# EasyEDA Pro project ProDoc_Board1_2026-06-09.epro

# Schematic Schematic1
Board Name: Board1; Create Date: 2025-09-25; Page Name: P1; Project Name: ESP32C3自动遥控; Schematic Name: Schematic1; Update Date: 2025-09-27; Company: 嘉立创EDA; Page Size: A4; Version: V1.0
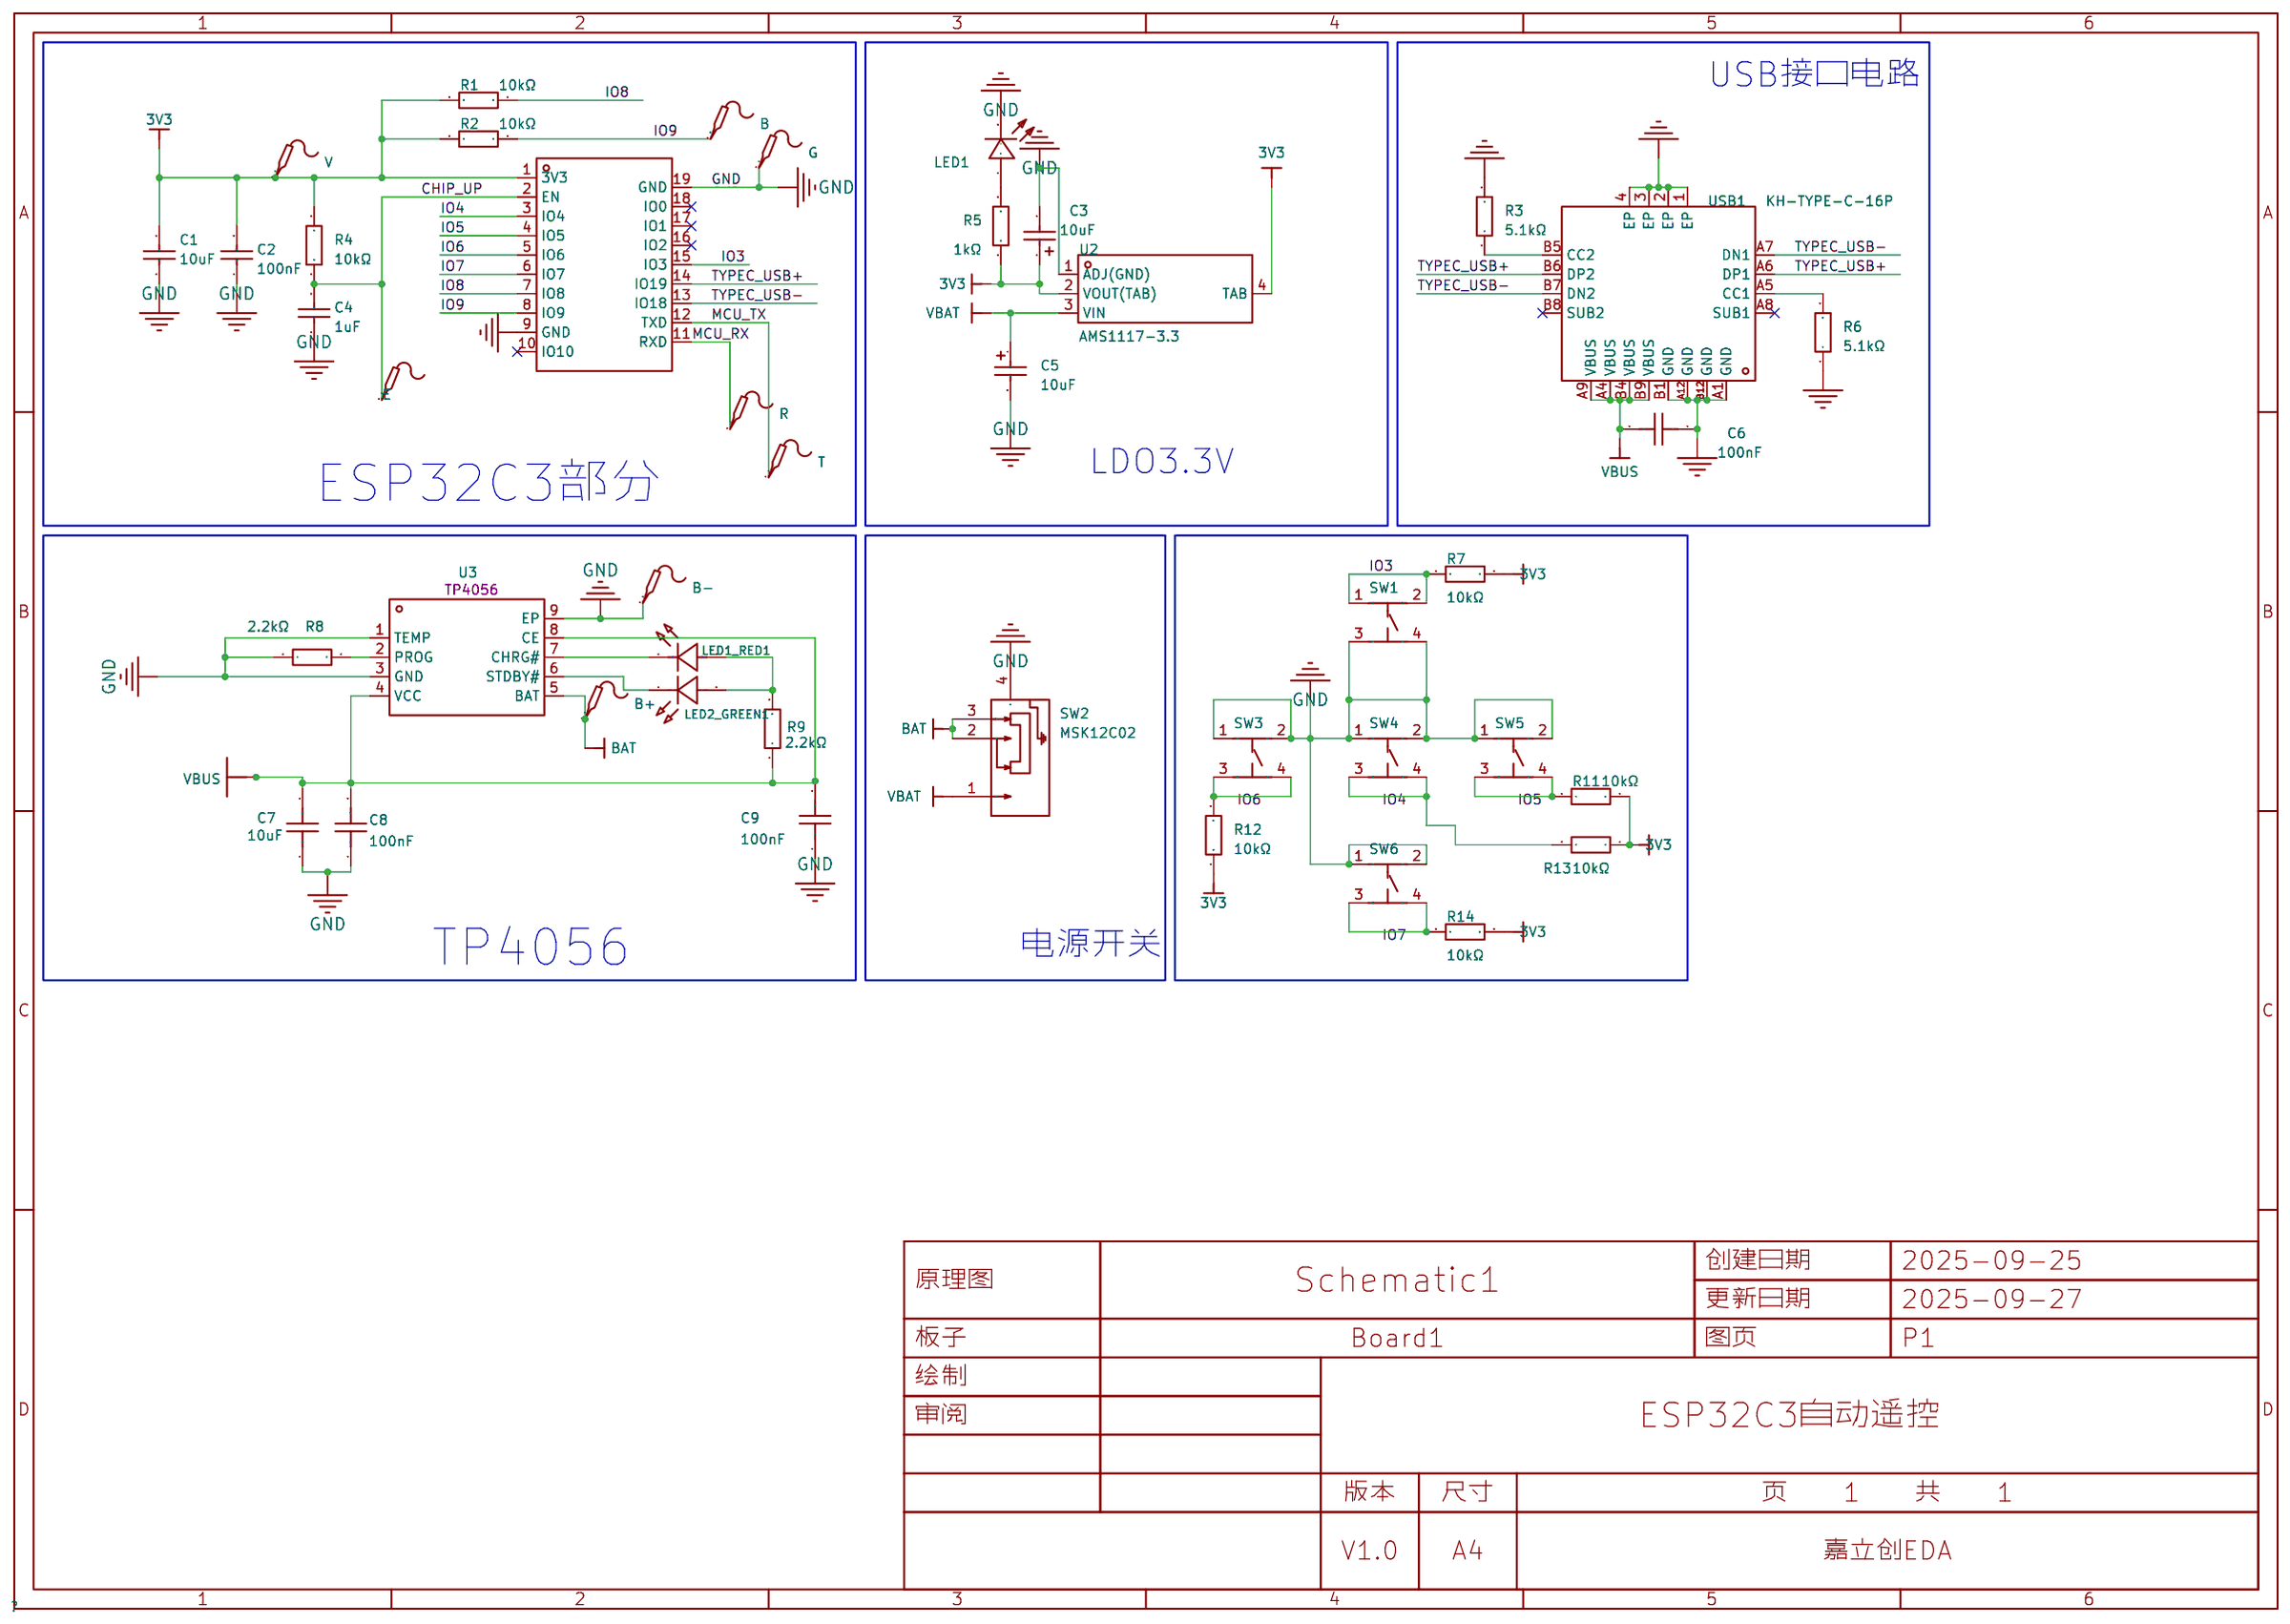
[diagram p0: schematic sheet]

## Parts
B  -  [Test-Point-0.5mm]
B+  -  [Test-Point-0.5mm]
B-  -  [Test-Point-0.5mm]
C1  10uF  [C0805]
C2  100nF  [C0805]
C3  10uF  [CAP-SMD_L3.2-W1.6-RD-C7171]
C4  1uF  [C0805]
C5  10uF  [CAP-SMD_L3.2-W1.6-RD-C7171]
C6  100nF  [C0603]
C7  10uF  [C0603]
C8  100nF  [C0603]
C9  100nF  [C0603]
E  -  [Test-Point-0.5mm]
G  -  [Test-Point-0.5mm]
LED1  NCD0805R1  [LED0805-R-RD]
LED1_RED1  -  [LED0805-RD_RED]
LED2_GREEN1  -  [LED0805-RD_GREEN]
R  -  [Test-Point-0.5mm]
R1  10kΩ  [R0805]
R2  10kΩ  [R0805]
R3  5.1kΩ  [R0603]
R4  10kΩ  [R0805]
R5  1kΩ  [R0805]
R6  5.1kΩ  [R0603]
R7  10kΩ  [R0805]
R8  2.2kΩ  [R0603]
R9  2.2kΩ  [R0603]
R11  10kΩ  [R0805]
R12  10kΩ  [R0805]
R13  10kΩ  [R0805]
R14  10kΩ  [R0805]
SW1  KH-6X6X5H-STM  [SW-SMD_4P-L6.0-W6.0-P4.50-LS9.0_H5.0]
SW2  MSK12C02  [SW-TH_MSK12C02]
SW3  KH-6X6X5H-STM  [SW-SMD_4P-L6.0-W6.0-P4.50-LS9.0_H5.0]
SW4  KH-6X6X5H-STM  [SW-SMD_4P-L6.0-W6.0-P4.50-LS9.0_H5.0]
SW5  KH-6X6X5H-STM  [SW-SMD_4P-L6.0-W6.0-P4.50-LS9.0_H5.0]
SW6  KH-6X6X5H-STM  [SW-SMD_4P-L6.0-W6.0-P4.50-LS9.0_H5.0]
T  -  [Test-Point-0.5mm]
U1  ESP32-C3-WROOM-02-H4  [WIFIM-SMD_18P-L20.0-W18.0-P1.50]
U2  AMS1117-3.3  [SOT-223-4_L6.5-W3.5-P2.30-LS7.0-BR]
U3  -  [ESOP-8_L4.9-W3.9-P1.27-LS6.0-BL-EP]
USB1  KH-TYPE-C-16P  [USB-C-SMD_KH-TYPE-C-16P]
V  -  [Test-Point-0.5mm]

## Library data of the parts
B B+ B- E G R T V = Test-Point: Test Point 测试点
C1 = CL21A106KOQNNNE: 容值:10uF;精度:±10%;额定电压:16V;材质(温度系数):X5R;; LCSC Part Name: 10uF ±10% 16V; Supplier Part: C1713; Manufacturer: SAMSUNG(三星); Supplier Footprint: 0805; JLCPCB Part Class: 扩展库; Datasheet: https://atta.szlcsc.com/upload/public/pdf/source/20160103/1457707694240.pdf; Supplier: LCSC; Tolerance: ±10%; Voltage Rated: 16V; Temperature Coefficient: X5R
C2 = 0805B104K500NT: 容值:100nF;精度:±10%;额定电压:50V;材质(温度系数):X7R;; LCSC Part Name: 100nF ±10% 50V; Supplier Part: C38141; Manufacturer: FH(风华); Supplier Footprint: 0805; JLCPCB Part Class: 扩展库; Datasheet: https://atta.szlcsc.com/upload/public/pdf/source/20170923/C38141_1506149447419988747.pdf; Supplier: LCSC; Tolerance: ±10%; Voltage Rated: 50V; Temperature Coefficient: X7R
C3 C5 = TAJA106K016RNJ: 容值:10uF;精度:±10%;额定电压:16V;等效串联电阻:3Ω@100kHz;; LCSC Part Name: 10uF ±10% 16V; Supplier Part: C7171; Manufacturer: Kyocera AVX; Supplier Footprint: CASE-A-3216; JLCPCB Part Class: 基础库; Datasheet: https://atta.szlcsc.com/upload/public/pdf/source/20160107/1457707748093.pdf; Supplier: LCSC; Tolerance: ±10%; Rated Voltage: 16V; Equivalent Series Resistance(ESR): 3Ω@100kHz; Operating Temperature: -55℃~+125℃
C4 = CL21B105KBFNNNE: 容值:1uF;精度:±10%;额定电压:50V;材质(温度系数):X7R;; LCSC Part Name: 1uF ±10% 50V; Supplier Part: C28323; Manufacturer: SAMSUNG(三星); Supplier Footprint: 0805; JLCPCB Part Class: 基础库; Datasheet: https://atta.szlcsc.com/upload/public/pdf/source/20160103/1457707718219.pdf; Supplier: LCSC; Tolerance: ±10%; Voltage Rated: 50V; Temperature Coefficient: X7R
C6 C8 C9 = CC0603KRX7R9BB104: 容值:100nF;精度:±10%;额定电压:50V;材质(温度系数):X7R;; LCSC Part Name: 100nF ±10% 50V; Supplier Part: C14663; Manufacturer: YAGEO(国巨); Supplier Footprint: 0603; JLCPCB Part Class: 基础库; Datasheet: https://atta.szlcsc.com/upload/public/pdf/source/20180910/C282072_33301C7F631E79921B82A8DAC6BCC5B3.pdf; Supplier: LCSC; Tolerance: ±10%; Voltage Rated: 50V; Temperature Coefficient: X7R
C7 = CL10A106KP8NNNC: 容值:10uF;精度:±10%;额定电压:10V;材质(温度系数):X5R;; LCSC Part Name: 10uF ±10% 10V; Supplier Part: C19702; Manufacturer: SAMSUNG(三星); Supplier Footprint: 0603; JLCPCB Part Class: 基础库; Datasheet: https://atta.szlcsc.com/upload/public/pdf/source/20160218/1457707763339.pdf; Supplier: LCSC; Tolerance: ±10%; Voltage Rated: 10V; Temperature Coefficient: X5R
LED1 = NCD0805R1: 灯头类型:-;发光颜色:红色;正向电压(VF):1.6V~2.6V;功率:65mW;正向电流:20mA;主波长:615nm~630nm;二极管配置:独立二极管;透镜颜色:无色透明透镜;色温:-;发光强度:67mcd~195mcd;发光角度:130°;载带方式:-;工作温度:-30℃~+85℃;; Supplier Part: C84256; Manufacturer: 国星光电; Supplier Footprint: 0805; JLCPCB Part Class: Basic Part; Datasheet: https://atta.szlcsc.com/upload/public/pdf/source/20200820/C84256_F0A75A43B3EAD75808600A0514C76B99.pdf; Supplier: LCSC; Emitted Color: 红色; Forward Voltage (VF): 1.6V~2.6V; Power Dissipation: 65mW; Forward Current: 20mA; Dominant Wavelength: 615nm~630nm; Diode Configuration: 独立二极管; Lens Color: 无色透明透镜; Luminous Intensity: 67mcd~195mcd; Viewing Angle: 130°; Operating Temperature: -30℃~+85℃
LED1_RED1 = RF-OGB170TS-CB-E0: 发光颜色:橙红;二极管配置:-;透镜颜色:-;主波长:-;峰值波长:-;色温:-;光通量(25时):-;测试电流:20mA;正向电压(VF):-;发光强度:-;功率:72mW;发光角度:140°;安装方式:正贴;工作温度:-40~+85;; LCSC Part Name: 橙红 正贴; Supplier Part: C2908307; Manufacturer: Refond(瑞丰); Supplier Footprint: 0805; Datasheet: https://atta.szlcsc.com/upload/public/pdf/source/20211101/17CF98FF0F75CAC71B7640EDEC18BF59.pdf; Supplier: LCSC; Emitted Color: 橙红; Forward Current: 20mA; Power Dissipation: 72mW; Viewing Angle: 140°; Mounting Sytle: 正贴; Operating Temperature: -40~+85
LED2_GREEN1 = XL-2012UGC: LCSC Part Name: 绿色; Supplier Part: C965815; Manufacturer: XINGLIGHT(成兴光); Supplier Footprint: 0805; JLCPCB Part Class: Extended Part; Datasheet: https://atta.szlcsc.com/upload/public/pdf/source/20210120/C965815_2FE53C37585AA3C6FB1151B9997EA267.pdf; Supplier: LCSC
R1 R2 R4 R7 R11-R14 = 0805W8F1002T5E_C17414: 电阻类型:厚膜电阻;阻值:10kΩ;精度:±1%;功率:125mW;; LCSC Part Name: 10kΩ ±1% 125mW; Supplier Part: C17414; Manufacturer: UNI-ROYAL(厚声); Manufacturer Part: 0805W8F1002T5E; Supplier Footprint: 0805; JLCPCB Part Class: 基础库; Datasheet: https://atta.szlcsc.com/upload/public/pdf/source/20200306/C422600_1E6D84923E4A46A82E41ADD87F860B5C.pdf; Supplier: LCSC; Type: 厚膜电阻; Tolerance: ±1%; Power(Watts): 125mW; Temperature Coefficient: ±100ppm/℃; Overload Voltage (Max): 150V; Operating Temperature Range: -55℃~+155℃
R3 R6 = 0603WAF5101T5E: 电阻类型:厚膜电阻;阻值:5.1kΩ;精度:±1%;功率:100mW;最大工作电压:75V;温度系数:±100ppm/℃;; LCSC Part Name: 5.1kΩ ±1% 100mW 厚膜电阻; Supplier Part: C23186; Manufacturer: UNI-ROYAL(厚声); Supplier Footprint: 0603; JLCPCB Part Class: 基础库; Datasheet: https://atta.szlcsc.com/upload/public/pdf/source/20200306/C422600_1E6D84923E4A46A82E41ADD87F860B5C.pdf; Supplier: LCSC; Type: 厚膜电阻; Tolerance: ±1%; Power(Watts): 100mW; Overload Voltage (Max): 75V; Temperature Coefficient: ±100ppm/℃; Operating Temperature Range: -55℃~+155℃
R5 = RC0805FR-071KL: 电阻类型:厚膜电阻;阻值:1kΩ;精度:±1%;功率:125mW;; LCSC Part Name: 1kΩ ±1% 125mW; Supplier Part: C95781; Manufacturer: YAGEO(国巨); Supplier Footprint: 0805; JLCPCB Part Class: 扩展库; Datasheet: https://atta.szlcsc.com/upload/public/pdf/source/20170228/1488267679154.pdf; Supplier: LCSC; Type: 厚膜电阻; Tolerance: ±1%; Power(Watts): 125mW; Temperature Coefficient: ±100ppm/℃; Overload Voltage (Max): 150V; Operating Temperature Range: -55℃~+155℃
R8 R9 = 0603WAF2201T5E: 电阻类型:厚膜电阻;阻值:2.2kΩ;精度:±1%;功率:100mW;最大工作电压:75V;温度系数:±100ppm/℃;; LCSC Part Name: 2.2kΩ ±1% 100mW 厚膜电阻; Supplier Part: C4190; Manufacturer: UNI-ROYAL(厚声); Supplier Footprint: 0603; JLCPCB Part Class: 基础库; Datasheet: https://atta.szlcsc.com/upload/public/pdf/source/20200306/C422600_1E6D84923E4A46A82E41ADD87F860B5C.pdf; Supplier: LCSC; Type: 厚膜电阻; Tolerance: ±1%; Power(Watts): 100mW; Overload Voltage (Max): 75V; Temperature Coefficient: ±100ppm/℃; Operating Temperature Range: -55℃~+155℃
SW1 SW3-SW6 = KH-6X6X5H-STM: 电路结构:单刀单掷;按钮形状:圆形按钮;安装方式:立贴;开关长度:6mm;开关宽度:6mm;开关高度:5mm;带支架:不带支架;触点电流:50mA;额定电压:12V;工作寿命:8万次;; LCSC Part Name: 6*6*5mm 立贴 轻触开关; Supplier Part: C2837531; Manufacturer: kinghelm(金航标); Supplier Footprint: SMD-4P,6x6mm; JLCPCB Part Class: 扩展库; Datasheet: https://item.szlcsc.com/datasheet/KH-6X6X5H-STM/3009601.html; Supplier: LCSC; Circuit: 单刀单掷; Actuator Style: 圆形按钮; Mounting Type: 立贴; Length: 6mm; Width: 6mm; Switch Height: 5mm; with Bracket: 不带支架; Contact Current: 50mA; Voltage Rating: 12V; Actuator/Cap Color: 黑色; Termination Style: 鸥翼型; Life: 8万次
SW2 = MSK12C02: 电路结构:单刀双掷;安装方式:卧贴;开关颜色:-;额定电流:50mA;额定电压:12V;工作寿命:1万次;; LCSC Part Name: 两档侧拨贴片 7脚 滑动开关; Supplier Part: C431540; Manufacturer: SHOU HAN(首韩); Supplier Footprint: SMD,8x2.8mm; JLCPCB Part Class: 扩展库; Datasheet: https://item.szlcsc.com/datasheet/MSK12C02/427897.html; Supplier: LCSC; Circuit: 单刀双掷; Termination Style: SMD接片; Length: 8mm; Width: 2.8mm; Switch Height: 1.4mm; Mounting Type: 卧贴; Current Rating: 50mA; Voltage Rating: 12V; Life: 1万次; Operating Temperature: -20℃~+70℃
U1 = ESP32-C3-WROOM-02-H4: Supplier Part: C2944070; Manufacturer: ESPRESSIF(乐鑫); Supplier Footprint: SMD-32P; JLCPCB Part Class: 扩展库; Datasheet: https://atta.szlcsc.com/upload/public/pdf/source/20220106/F07459EFFE1D7CBA94B4FB8A075146A6.pdf; Supplier: LCSC
U2 = AMS1117-3.3_C347222: 输出类型:固定;最大输入电压:18V;输出电压:3.3V;输出电流:1A;电源纹波抑制比(PSRR):60dB@(120Hz);输出极性:正极;; LCSC Part Name: 输出:3.3V 电流:1A 耐压:12V; Supplier Part: C347222; Manufacturer: UMW(友台半导体); Supplier Footprint: SOT-223; JLCPCB Part Class: Extended Part; Datasheet: https://atta.szlcsc.com/upload/public/pdf/source/20231109/155D79A26D9DB04352555A58D5969DC8.pdf; Supplier: LCSC; Output Type: 固定; Output Polarity: 正极; Number of Outputs: 1; Maximum Input Voltage: 18V; Output Voltage: 3.3V; Dropout Voltage: 1.3V@(1A); Output Current: 1A; Power Supply Rejection Ratio (PSRR): 60dB@(120Hz); Feature: 过流保护(OCP)
U3 = TP4056_1: 充电电池的类型:-;电池单元组数:-;最大充电电流:-;充满的电池组电压:-;最大供应电压:-;; LCSC Part Name: 1A鋰電池充電IC; Supplier Part: C382139; Manufacturer: TPOWER(天源); Manufacturer Part: TP4056; Supplier Footprint: ESOP-8; JLCPCB Part Class: Extended Part; Datasheet: https://atta.szlcsc.com/upload/public/pdf/source/20190327/C382139_EC85960E6FE3E26856C240C81751A184.pdf; Supplier: LCSC
USB1 = KH-TYPE-C-16P: 连接器类型:Type-C;标准:-;公母:母座;触点数量:16;端口数量:1;安装方式:卧贴;额定电流 - 电源:3A;工作温度范围:-40℃~+85℃;; LCSC Part Name: Type-C 母座 卧贴; Supplier Part: C709357; Manufacturer: kinghelm(金航标); Supplier Footprint: SMD; JLCPCB Part Class: 扩展库; Datasheet: https://atta.szlcsc.com/upload/public/pdf/source/20200911/C709357_AA8DCEB38BB20E3035A7ED7AE7667837.pdf; Supplier: LCSC; Connector Type: Type-C; Gender: 母座; Number of Contacts: 16; Number of Ports: 1; Mounting Style: 卧贴; Current Rating - Power (Max): 3A; Operating Temperature Range: -40℃~+85℃

## Nets
3V3: C1.2 C2.2 C3.1 R1.2 R2.2 R4.2 R5.1 R7.1 R11.1 R12.1 R13.1 R14.1 U1.1(3V3) U2.2(VOUT(TAB)) U2.4(TAB) V.1
GND: B-.1 C1.1 C2.1 C3.2 C4.1 C5.2 C6.1 C7.1 C8.1 C9.1 G.1 LED1.2(-) R3.2 R6.1 R8.1 SW1.3 SW1.4 SW2.4 SW3.1 SW3.2 SW4.1 SW4.2 SW5.1 SW5.2 SW6.1 SW6.2 U1.9(GND) U1.19(GND) U2.1(ADJ(GND)) U3.1(TEMP) U3.3(GND) U3.9(EP) USB1.1(EP) USB1.2(EP) USB1.3(EP) USB1.4(EP) USB1.A1(GND) USB1.A12(GND) USB1.B1(GND) USB1.B12(GND)
VBAT: C5.1 SW2.1 U2.3(VIN)
VBUS: C6.2 C7.2 C8.2 C9.2 R9.1 U3.4(VCC) U3.8(CE) USB1.A4(VBUS) USB1.A9(VBUS) USB1.B4(VBUS) USB1.B9(VBUS)
BAT: B+.1 SW2.2 SW2.3 U3.5(BAT)
CHIP_UP: C4.2 E.1 R4.1 U1.2(EN)
IO3: R7.2 SW1.1 SW1.2 U1.15(IO3)
IO4: R13.2 SW4.3 SW4.4 U1.3(IO4)
IO5: R11.2 SW5.3 SW5.4 U1.4(IO5)
IO6: R12.2 SW3.3 SW3.4 U1.5(IO6)
IO7: R14.2 SW6.3 SW6.4 U1.6(IO7)
IO8: R1.1 U1.7(IO8)
IO9: B.1 R2.1 U1.8(IO9)
MCU_RX: R.1 U1.11(RXD)
MCU_TX: T.1 U1.12(TXD)
TYPEC_USB+: U1.14(IO19) USB1.A6(DP1) USB1.B6(DP2)
TYPEC_USB-: U1.13(IO18) USB1.A7(DN1) USB1.B7(DN2)
$1N1082: LED1.1(+) R5.2
$1N1664: R6.2 USB1.A5(CC1)
$1N1672: R3.1 USB1.B5(CC2)
$1N2670: R8.2 U3.2(PROG)
$1N2673: LED2_GREEN1.1(K) U3.6(STDBY#)
$1N2674: LED1_RED1.1(K) U3.7(CHRG#)
$1N2675: LED1_RED1.2(A) LED2_GREEN1.2(A) R9.2

Not connected (* = marked no-connect by the designer): U1 10(IO10)* 16(IO2)* 17(IO1)* 18(IO0)*; USB1 A8(SUB1)* B8(SUB2)*

## Notes on the sheet
- USB接口电路
- LDO3.3V
- ESP32C3部分
- 电源开关
- TP4056

# Board PCB1
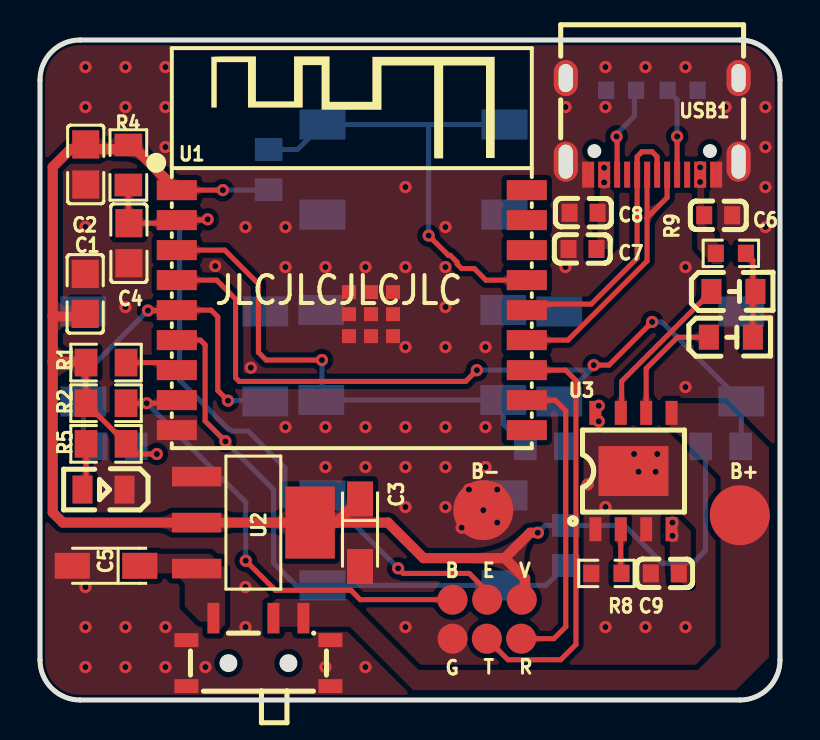
[diagram p1: board, top side]
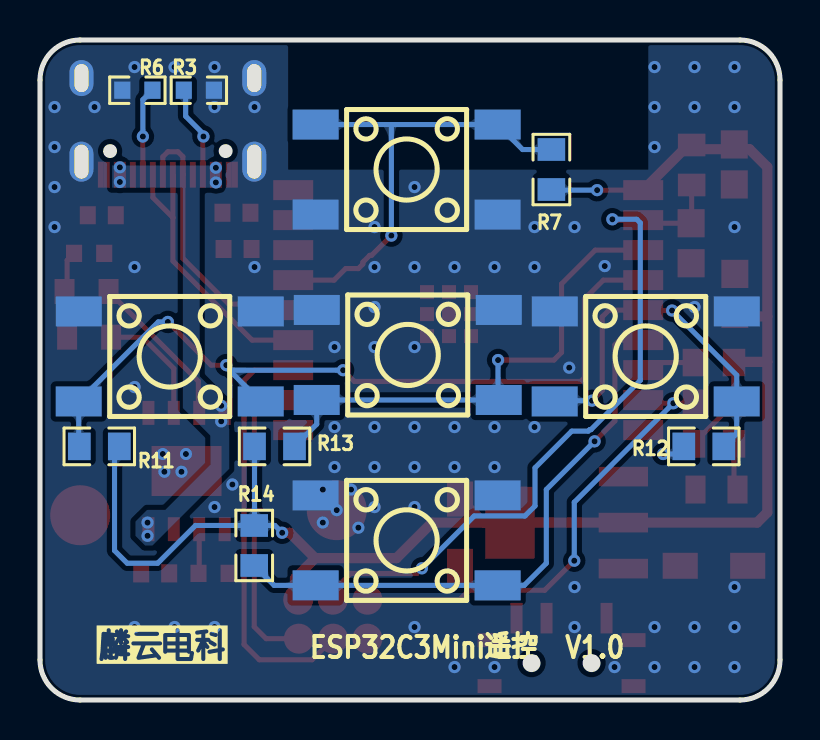
[diagram p2: board, bottom side, seen from below]

Outline 37 x 33 mm; copper layers: Top Layer, Bottom Layer. Coordinates in mm from the lower left corner of the outline.
Outline path: 0,31 0,2 arc(0.59,0.59) 2,0 35,0 arc(36.41,0.59) 37,2 37,31 arc(36.41,32.41) 35,33 2,33 arc(0.59,32.41) 0,31
Stack: Top Layer 0.035mm / Dielectric1 1.51mm FR4 er 4.5 / Bottom Layer 0.035mm

## Design rules (mm)
spacing copperThickness1oz (default): track to track 0.102, other pairs 0.152 to 0.3
spacing copperThickness2oz: track to track 0.203, other pairs 0.152 to 0.3
spacing Plane_innerPlane: track to track 0.102, other pairs 0.152 to 0.3
spacing Copper_copperRegion: track to track 0.102, other pairs 0.152 to 0.3
track width copperThickness1oz (default): min 0.127, default 0.254, max 2.54
track width copperThickness2oz: min 0.203, default 0.254, max 2.54
differential pair differentialPair (default): width min 0.127, default 0.254, max 2.54; gap min 0.152, default 0.152
pour e301 uses Copper_copperRegion
pour e309 uses Copper_copperRegion

## Placement (name value [footprint] x y rotation side)
B  -  [Test-Point-0.5mm]  20.63 5.02 0 top
B+  -  [Test-Point-0.5mm#2]  34.99 9.24 0 top
B-  -  [Test-Point-0.5mm#2]  22.16 9.49 0 top
C1  10uF  [C0805]  2.26 20.31 270 top
C2  100nF  [C0805]  2.29 26.78 90 top
C3  10uF  [CAP-SMD_L3.2-W1.6-RD-C7171]  16 8.36 270 top
C4  1uF  [C0805]  4.44 22.84 90 top
C5  10uF  [CAP-SMD_L3.2-W1.6-RD-C7171]  3.3 6.71 180 top
C6  100nF  [C0603]  33.91 24.24 180 top
C7  10uF  [C0603]  27.12 22.55 0 top
C8  100nF  [C0603]  27.18 24.36 0 top
C9  100nF  [C0603]  31.24 6.33 0 top
E  -  [Test-Point-0.5mm]  22.36 5.02 0 top
G  -  [Test-Point-0.5mm]  20.63 3.07 0 top
LED1  NCD0805R1  [LED0805-R-RD]  3.18 10.52 180 top
LED1_RED1  -  [LED0805-RD_RED]  34.67 20.43 0 top
LED2_GREEN1  -  [LED0805-RD_GREEN]  34.54 18.14 0 top
R  -  [Test-Point-0.5mm]  24.06 3.07 180 top
R1  10kΩ  [R0805]  3.3 16.87 180 top
R2  10kΩ  [R0805]  3.3 14.84 180 top
R3  5.1kΩ  [R0603]  29.06 30.49 180 bottom
R4  10kΩ  [R0805]  4.42 26.75 90 top
R5  1kΩ  [R0805]  3.3 12.81 180 top
R6  5.1kΩ  [R0603]  32.13 30.49 180 bottom
R7  10kΩ  [R0805]  11.43 26.52 90 bottom
R8  2.2kΩ  [R0603]  28.32 6.33 0 top
R9  2.2kΩ  [R0603]  34.54 22.33 0 top
R11  10kΩ  [R0805]  34.04 12.68 0 bottom
R12  10kΩ  [R0805]  3.81 12.68 180 bottom
R13  10kΩ  [R0805]  25.27 12.68 180 bottom
R14  10kΩ  [R0805]  26.29 7.73 270 bottom
SW1  KH-6X6X5H-STM  [SW-SMD_4P-L6.0-W6.0-P4.50-LS9.0_H5.0]  18.67 26.52 180 bottom
SW2  MSK12C02  [SW-TH_MSK12C02]  10.92 2.39 0 top
SW3  KH-6X6X5H-STM  [SW-SMD_4P-L6.0-W6.0-P4.50-LS9.0_H5.0]  6.71 17.18 180 bottom
SW4  KH-6X6X5H-STM  [SW-SMD_4P-L6.0-W6.0-P4.50-LS9.0_H5.0]  18.61 17.25 180 bottom
SW5  KH-6X6X5H-STM  [SW-SMD_4P-L6.0-W6.0-P4.50-LS9.0_H5.0]  30.51 17.18 180 bottom
SW6  KH-6X6X5H-STM  [SW-SMD_4P-L6.0-W6.0-P4.50-LS9.0_H5.0]  18.67 7.98 180 bottom
T  -  [Test-Point-0.5mm]  22.34 3.07 180 top
U1  ESP32-C3-WROOM-02-H4  [WIFIM-SMD_18P-L20.0-W18.0-P1.50]  15.59 19.49 0 top
U2  AMS1117-3.3  [SOT-223-4_L6.5-W3.5-P2.30-LS7.0-BR]  10.67 8.87 180 top
U3  -  [ESOP-8_L4.9-W3.9-P1.27-LS6.0-BL-EP]  29.67 11.45 0 top
USB1  KH-TYPE-C-16P  [USB-C-SMD_KH-TYPE-C-16P]  30.61 28.68 180 top
V  -  [Test-Point-0.5mm]  24.09 5.02 0 top

## Footprints (pads in the part's own frame, mm; a bottom-side part is the same pattern mirrored in y, then rotated)
C0603
  rect 0.8x0.9 smd: 1(-0.7,0) 2(0.7,0)
C0805
  rect 1.41x1.35 smd: 1(-1,0) 2(1,0)
CAP-SMD_L3.2-W1.6-RD-C7171
  rect 1.758x1.296 smd: 1(-1.687,0) 2(1.687,0)
ESOP-8_L4.9-W3.9-P1.27-LS6.0-BL-EP
  rect 0.6x1.199 smd: 1(-1.905,-2.909) 2(-0.635,-2.909) 3(0.635,-2.909) 4(1.905,-2.909) 5(1.905,2.909) 6(0.635,2.909) 7(-0.635,2.909) 8(-1.905,2.909)
  rect 3.5x2.499 smd: 9(0,0)
LED0805-R-RD
  rect 1x1.399 smd: 1(1.05,0) 2(-1.05,0)
LED0805-RD_GREEN
  rect 1.001x1.25 smd: 1(-1.1,0) 2(1.1,0)
LED0805-RD_RED
  rect 1x1.25 smd: 1(-1.1,0) 2(1.1,0)
R0603
  rect 0.806x0.864 smd: 1(-0.753,0) 2(0.753,0)
R0805
  rect 1.133x1.377 smd: 1(-1,0) 2(1,0)
SOT-223-4_L6.5-W3.5-P2.30-LS7.0-BR
  rect 2.47x0.98 smd: 1(2.835,-2.3) 2(2.835,0) 3(2.835,2.3)
  rect 2.47x3.6 smd: 4(-2.835,0)
SW-SMD_4P-L6.0-W6.0-P4.50-LS9.0_H5.0
  rect 2.3x1.5 smd: 1(-4.55,2.25) 2(4.55,2.25) 3(-4.55,-2.25) 4(4.55,-2.25)
SW-TH_MSK12C02
  rect 0.6x1.524 smd: 1(-2.25,1.7) 2(0.75,1.7) 3(2.25,1.7)
  rect 1.2x0.7 smd: 4(-3.6,0.6) 4(-3.6,-1.7) 4(3.6,0.6) 4(3.6,-1.7)
Test-Point-0.5mm
  round 1.5 smd: 1(0,0)
Test-Point-0.5mm#2
  round 3 smd: 1(0,0)
USB-C-SMD_KH-TYPE-C-16P
  oval 1.2x2 hole 0.7x1.7: 1(-4.32,1.765) 2(4.32,1.765)
  oval 1.2x1.8 hole 0.7x1.4: 3(-4.32,-2.415) 4(4.32,-2.415)
  rect 0.3x1.3 smd: A1(-3.35,2.415) A4(-2.55,2.415) A5(-1.25,2.415) A6(-0.25,2.415) A7(0.25,2.415) A8(1.25,2.415) A9(2.55,2.415) A12(3.35,2.415) B1(3.05,2.415) B4(2.25,2.415) B5(1.75,2.415) B6(0.75,2.415) B7(-0.75,2.415) B8(-1.75,2.415) B9(-2.25,2.415) B12(-3.05,2.415)
WIFIM-SMD_18P-L20.0-W18.0-P1.50
  rect 2x1 smd: 1(-8.75,6) 2(-8.75,4.5) 3(-8.75,3) 4(-8.75,1.5) 5(-8.75,0) 6(-8.75,-1.5) 7(-8.75,-3) 8(-8.75,-4.5) 9(-8.75,-6) 10(8.75,-6) 11(8.75,-4.5) 12(8.75,-3) 13(8.75,-1.5) 14(8.75,0) 15(8.75,1.5) 16(8.75,3) 17(8.75,4.5) 18(8.75,6)
  rect 0.7x0.7 smd: 19(-0.14,0.9) 19(-0.14,-0.2) 19(-0.14,-1.3) 19(0.96,0.9) 19(0.96,-0.2) 19(0.96,-1.3) 19(2.06,0.9) 19(2.06,-0.2) 19(2.06,-1.3)

## Nets
As in the schematic.

Pads without a net: U1 10 16 17 18; USB1 A8 B8

## Via types
v1: diameter 0.61, hole 0.305, Top Layer to Bottom Layer, 102 vias

## Routing (per net, layer and track width the routed paths; a pad name or vN(x,y) marks a point on that pad's centre or on a via; arc(x,y) is an arc through that point)
3V3: length 89.6
  Top Layer w0.254: U1.1 v1(9.14,25.49) ; v1(5.84,12.3) 4.81,12.3 R5.1 4.3,12.84 R2.2 R1.2
  Top Layer w0.508: 0.64,16.91 2.26,16.91 R1.2 ; 0.64,16.91 0.64,9.38 1.14,8.87 U2.2 U2.4 14.82,8.87 ; 0.64,16.91 0.64,19.18 ; U1.1 4.58,27.75 R4.2 4.21,27.54 1.52,27.54 0.64,26.65 0.64,19.18 ; 14.82,8.87 17.4,8.87 19.18,7.09 23.24,7.09 ; 14.82,8.87 C3.1 ; 23.24,7.09 24.51,8.36 v1(24.89,8.36) ; 23.24,7.09 24.26,6.08 24.26,5.19 V.1 ; 0.64,19.18 2.13,19.18 C1.2
  Bottom Layer w0.254: v1(5.84,12.3) 5.19,12.3 R12.1 ; 25.96,8.73 26.27,9.04 R13.1 ; 25.96,8.73 25.26,8.73 v1(24.89,8.36) ; 25.96,8.73 R14.1 29.23,8.73 31.12,6.84 32.64,6.84 33.27,7.47 33.27,12.44 R11.1 ; R7.1 11.4,25.49 v1(9.14,25.49)
GND:
  vias: v1(2.27,31.65) v1(2.27,29.65) v1(2.27,23.65) v1(2.27,5.65) v1(2.27,3.65) v1(2.27,1.65) v1(4.27,31.65) v1(4.27,29.65) v1(4.27,19.65) v1(4.27,3.65) v1(4.27,1.65) v1(6.27,31.65) v1(6.27,29.65) v1(6.27,27.65) v1(6.27,3.65) v1(6.27,1.65) v1(8.27,1.65) v1(8.76,21.7) v1(10.27,23.65) v1(10.27,5.65) v1(10.27,3.65) v1(10.54,16.62) v1(12.27,23.65) v1(12.27,21.65) v1(12.27,13.65) v1(14.27,21.65) v1(14.27,13.65) v1(14.27,11.65) v1(14.27,1.65) v1(16.27,21.65) v1(16.27,13.65) v1(16.27,11.65) v1(16.27,1.65) v1(18.27,25.65) v1(18.27,21.65) v1(18.27,17.65) v1(18.27,13.65) v1(18.27,11.65) v1(18.27,9.65) v1(18.27,3.65) v1(20.27,23.65) v1(20.27,21.65) v1(20.27,19.65) v1(20.27,17.65) v1(20.27,13.65) v1(20.27,11.65) v1(20.27,9.65) v1(21.08,8.62) v1(21.45,10.52) v1(22.16,9.49) v1(22.27,17.65) v1(22.27,13.65) v1(22.27,11.65) v1(22.86,10.52) v1(22.86,8.87) v1(26.27,29.65) v1(26.27,21.65) v1(27.38,10.78) v1(28.27,31.65) v1(28.27,29.65) v1(28.27,9.65) v1(28.27,3.65) v1(29.7,12.3) v1(29.93,11.41) v1(30.27,31.65) v1(30.27,3.65) v1(30.78,11.41) v1(30.86,12.3) v1(32.27,31.65) v1(32.27,21.65) v1(32.27,15.65) v1(32.27,3.65) v1(34.27,29.65) v1(36.27,29.65) v1(36.27,27.65) v1(36.27,25.65) v1(36.27,23.65)
VBUS:
  vias: v1(27.94,14.71) v1(27.94,13.93) v1(28.21,26.61) v1(28.21,25.88) v1(31.62,8.87) v1(31.62,8.21) v1(33.01,26.63) v1(33.01,25.9)
CHIP_UP: length 36.6
  Top Layer w0.254: v1(17.91,6.58) 18.16,6.33 21.46,6.33 22.36,5.44 E.1 ; R4.1 4.42,23.87 C4.2 6.69,23.84 U1.2 8.34,23.99 v1(8.38,24.04)
  Bottom Layer w0.254: v1(8.38,24.04) 7.16,24.04 6.99,23.86 6.99,15.98 9.45,13.52 9.51,13.52 9.59,13.44 10.41,13.44 12.25,11.61 12.25,9.7 12.75,9.2 15.29,9.2 v1(17.91,6.58)
IO3: length 24
  Top Layer w0.254: v1(19.43,23.22) 20.42,22.23 20.52,22.23 20.86,21.89 20.86,21.8 21.08,21.57 21.72,21.57 22.29,20.99 U1.15
  Bottom Layer w0.254: SW1.1 19.19,28.77 ; 19.19,28.77 19.43,28.77 v1(19.43,23.22) ; 19.19,28.77 SW1.2 12.87,27.52 R7.2
IO4: length 25.4
  Top Layer w0.254: U1.3 9.24,22.49 10.92,20.81 10.92,17.38 11.3,17 v1(14.1,17)
  Bottom Layer w0.254: R13.2 23.16,13.79 SW4.3 SW4.4 14.1,15.04 v1(14.1,17)
IO5: length 40.3
  Top Layer w0.254: v1(27.69,16.74) 28.45,16.74 v1(30.61,18.9) ; v1(21.84,16.49) 21.28,15.93 9.96,15.93 9.78,16.11 9.78,20.05 8.83,20.99 U1.4
  Bottom Layer w0.254: v1(30.61,18.9) 31.09,18.9 SW5.3 35.06,12.71 R11.2 ; SW5.4 27.69,16.65 v1(27.69,16.74) 27.43,16.49 v1(21.84,16.49)
IO6: length 18.3
  Top Layer w0.254: v1(9.4,14.97) 8.89,15.47 8.89,19.16 8.55,19.49 U1.5 6.82,19.47 v1(5.4,19.47)
  Bottom Layer w0.254: R12.2 2.16,13.33 SW3.4 2.16,16.24 v1(5.4,19.47) ; v1(9.4,14.97) 11.22,14.97 SW3.3
IO7: length 29.3
  Top Layer w0.254: v1(9.27,12.93) 8.25,13.95 8.25,17.76 8.02,17.99 U1.6
  Bottom Layer w0.254: v1(9.27,12.93) 11.68,10.52 11.68,6.84 12.79,5.73 25.29,5.73 R14.2
IO8: length 2.7
  Top Layer w0.254: U1.7 6.46,16.87 R1.1
IO9: length 23.7
  Top Layer w0.254: R2.1 6.69,14.84 U1.8 ; B.1 16.02,5.02 15.54,5.49 11.77,5.49 v1(10.29,6.97)
  Bottom Layer w0.254: v1(5.33,14.84) 10.29,9.89 v1(10.29,6.97)
MCU_RX: length 15.4
  Top Layer w0.254: R.1 25.69,3.07 26.29,3.66 26.29,14.46 25.75,14.99 U1.11
MCU_TX: length 21.1
  Top Layer w0.254: U1.12 26.29,16.49 26.8,15.98 26.8,2.77 26.03,2.01 23.4,2.01 T.1
TYPEC_USB+: length 13.8
  Top Layer w0.254: U1.14 24.64,19.79 27.56,19.79 29.86,22.09 29.86,27.17 30.1,27.41 30.61,27.41 30.86,27.16 30.86,26.27
TYPEC_USB-: length 14.5
  Top Layer w0.254: 30.35,24.12 30.35,26.26 30.36,26.27 ; 30.35,24.12 30.35,21.95 26.4,17.99 U1.13 ; 30.35,24.12 31.36,25.12 31.36,26.27
$1N1082: length 2.4
  Top Layer w0.254: LED1.1 2.3,10.7 R5.2
$1N1664: length 4.4
  Top Layer w0.254: 31.86,26.27 v1(31.86,28.17)
  Bottom Layer w0.254: R6.2 31.86,30.01 v1(31.86,28.17)
$1N1672: length 4.6
  Top Layer w0.254: 28.86,26.27 28.86,28.15 v1(28.83,28.17)
  Bottom Layer w0.254: R3.1 29.72,30.4 29.72,29.19 28.83,28.3 v1(28.83,28.17)
$1N2670: length 2.2
  Top Layer w0.254: U3.2 29.04,6.37 R8.2
$1N2673: length 6
  Top Layer w0.254: LED2_GREEN1.1 31.88,18.14 30.31,16.57 U3.6
$1N2674: length 7.9
  Top Layer w0.254: U3.7 29.08,14.4 29.08,15.94 LED1_RED1.1
$1N2675: length 4.3
  Top Layer w0.254: LED2_GREEN1.2 35.64,21.99 R9.2

## Copper pours and planes (outline as drawn; the poured copper is in the pictures)
GND on Top Layer: -7.75,43.29 43.81,43.29 43.81,-11.96 -7.75,-11.96
GND on Bottom Layer: -10.35,-6.75 -10.35,44.81 44.89,44.81 44.89,-6.75
VBAT on Top Layer: 4.38,7.31 9.26,7.31 9.26,3.41 4.38,3.41
VBUS on Top Layer: 27.88,26.35 28.7,26.35 28.7,22.55 27.88,22.55
VBUS on Top Layer: 32.86,26.61 34.11,26.61 34.11,21.8 32.86,21.8
VBUS on Top Layer: 31.37,9.12 32.54,9.12 32.54,5.71 31.37,5.71
VBUS on Bottom Layer: 27.54,15.15 32.22,15.15 32.22,7.73 27.54,7.73
VBUS on Bottom Layer: 27.56,26.59 29.86,26.59 29.86,13.19 27.56,13.19
VBUS on Bottom Layer: 27.99,26.73 33.4,26.73 33.4,25.62 27.99,25.62
BAT on Top Layer: 11.43,14.84 36.45,14.84 36.45,0.49 11.43,0.49

Small or netless copper shapes (teardrops, artwork), in the pictures only: 81 on Top Layer, 51 on Bottom Layer

## Text on the board
Bottom Silkscreen Layer: ESP32C3Mini遥控  V1.0 | 麟云电科
Top Silkscreen Layer: JLCJLCJLCJLC
